# Altium schematic sheet RF_TRANSMITTER_Schematic.SchDoc
size A4; SheetNumber: 1; SheetTotal: 1
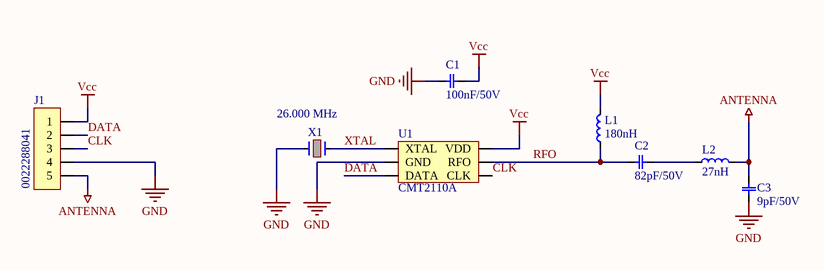
[diagram p0: RF_TRANSMITTER_Schematic.SchDoc]

## Parts
C1  100nF/50V  [Cap_0805]
C2  82pF/50V  [Cap_0805]
C3  9pF/50V  [Cap_0805]
J1  0022288041  [HDR_MALE_1x5_100mil_90DRC]
L1  180nH  [FERRITEBEAD_0805]
L2  27nH  [FERRITEBEAD_0805]
U1  CMT2110A  [SOT-23-6]
X1  26.000 MHz  [HC-49/US]

## Nets
ANTENNA: C3.2 J1.5 L2.2
GND: C1.1 C3.1 J1.4 U1.2(GND) X1.1
Vcc: C1.2 J1.1 L1.2 U1.6(VDD)
CLK: J1.3 U1.4(CLK)
DATA: J1.2 U1.3(DATA)
RFO: C2.2 L1.1 U1.5(RFO)
XTAL: U1.1(XTAL) X1.2
NetC2_1: C2.1 L2.1

## Library data of the parts
C1 = C2012X7R1H104K125AE: CAP CER nF 100 50V X7R 0805; Manufacturer: TDK Corporation; Tolerance: ±10%; Supplier 1: Digi-Key; Manufacturer Part Number: C2012X7R1H104K125AE; RoHS: RoHS Compliant; Category: Capacitors; Stock 1: 21863; Pricing 1: 1=0.29, 10=0.197, 100=0.1118, 500=0.07894, 1000=0.06907 (USD); Packaging: Cut Tape (CT); Part Status: Active; Voltage - Rated: 50V; Temperature Coefficient: X7R; Operating Temperature: -55°C ~ 125°C; Features: Soft Termination; Ratings: -; Applications: Boardflex Sensitive; Failure Rate: -; Mounting Type: Surface Mount, MLCC; Package / Case: 0805 (2012 Metric); Size / Dimension: 0.079" L x 0.049" W (2.00mm x 1.25mm); Height - Seated (Max): -; Thickness (Max): 0.057" (1.45mm); Lead Spacing: -; Lead Style: -; ComponentLink1URL: https://product.tdk.com/info/en/catalog/datasheets/mlcc_commercial_soft_en.pdf; ComponentLink1Description: https://product.tdk.com/info/en/catalog/datasheets/mlcc_commercial_soft_en.pdf; Supplier Part Number 1: 445-15929-1-ND
C2 = CC0805JRNPO9BN820: CAP CER pF 82 50V C0G/NPO 0805; Manufacturer: Yageo; Material: Ceramic; Capacitance: 82pF; Tolerance: 5%; Dielectric: C0G; Supplier 1: Digi-Key; Manufacturer Part Number: CC0805JRNPO9BN820; RoHS: Yes; Category: Ceramic Capacitors; Stock 1: 76000; Pricing 1: 4000=0,01566, 8000=0,01430 (USD); Mount: Surface Mount; Case/Package: 0805; Case Code (Imperial): 0805; Case Code (Metric): 2012; Weight: 0.000194oz; Min Operating Temperature: -55°C; Max Operating Temperature: 125°C; Package Quantity: 1; Voltage Rating: 50V; Voltage Rating (DC): 50V; Packaging: Tape and Reel; Termination: SMD/SMT; Resistor Type: Ceramic; Series: CC; Length: 2mm; Width: 1.25mm; Height: 0.6mm; Thickness: 0.024inch; Depth: 1.25mm; Radiation Hardening: No; Lead Free: Lead Free; RoHS Compliant: Yes; ComponentLink1URL: https://datasheet.ciiva.com/15189/getdatasheetpartid-137824-15189191.pdf?src-supplier=Verical; ComponentLink1Description: https://datasheet.ciiva.com/15189/getdatasheetpartid-137824-15189191.pdf?src-supplier=Verical; ComponentLink2URL: https://datasheet.ciiva.com/144/mlccorderingcode-144858.pdf?src-supplier=Digi-Key; ComponentLink2Description: https://datasheet.ciiva.com/144/mlccorderingcode-144858.pdf?src-supplier=Digi-Key; ComponentLink3URL: https://datasheet.ciiva.com/11586/upy-gp-np0-16v-to-50v-8-11586219.pdf?src-supplier=Avnet; ComponentLink3Description: https://datasheet.ciiva.com/11586/upy-gp-np0-16v-to-50v-8-11586219.pdf?src-supplier=Avnet; ComponentLink4URL: https://datasheet.ciiva.com/17434/upy-gp-np0-16v-to-50v-8-17434828.pdf?src-supplier=Avnet+Europe; ComponentLink4Description: https://datasheet.ciiva.com/17434/upy-gp-np0-16v-to-50v-8-17434828.pdf?src-supplier=Avnet+Europe; ComponentLink5URL: https://datasheet.ciiva.com/144/mlccorderingcode-144857.pdf?src-supplier=Digi-Key; ComponentLink5Description: https://datasheet.ciiva.com/144/mlccorderingcode-144857.pdf?src-supplier=Digi-Key; ComponentLink6URL: https://datasheet.ciiva.com/144/mlccorderingcode-144859.pdf?src-supplier=Digi-Key; ComponentLink6Description: https://datasheet.ciiva.com/144/mlccorderingcode-144859.pdf?src-supplier=Digi-Key; Supplier Part Number 1: 311-1110-2-ND
C3 = CC0805DRNPO9BN9R0: CAP CER pF 9 50V C0G/NPO 0805; Manufacturer: Yageo; Capacitance: 9pF; Dielectric: C0G; Supplier 1: Digi-Key; Manufacturer Part Number: CC0805DRNPO9BN9R0; RoHS: Yes; Category: Ceramic Capacitors; Stock 1: 20741; Pricing 1: 1=0,12000, 10=0,08400, 50=0,04740, 100=0,03930, 500=0,02754, 1000=0,02280 (USD); Mount: Surface Mount; Case/Package: 0805; Case Code (Metric): 2012; Case Code (Imperial): 0805; Weight: 0.000194oz; Min Operating Temperature: -55°C; Max Operating Temperature: 125°C; Package Quantity: 1; Voltage Rating: 50V; Packaging: Tape and Reel; Voltage Rating (DC): 50V; Termination: SMD/SMT; Series: CC; Length: 0.079inch; Width: 0.049inch; Thickness: 0.024inch; RoHS Compliant: Yes; ComponentLink1URL: https://datasheet.ciiva.com/176/mlccorderingcode-176816.pdf?src-supplier=Digi-Key; ComponentLink1Description: https://datasheet.ciiva.com/176/mlccorderingcode-176816.pdf?src-supplier=Digi-Key; ComponentLink2URL: https://datasheet.ciiva.com/176/mlccorderingcode-176817.pdf?src-supplier=Digi-Key; ComponentLink2Description: https://datasheet.ciiva.com/176/mlccorderingcode-176817.pdf?src-supplier=Digi-Key; ComponentLink3URL: https://datasheet.ciiva.com/176/mlccorderingcode-176818.pdf?src-supplier=Digi-Key; ComponentLink3Description: https://datasheet.ciiva.com/176/mlccorderingcode-176818.pdf?src-supplier=Digi-Key; Supplier Part Number 1: 311-1098-1-ND
J1 = 0022288041: CONN HEADER 4POS 2.54MM R/A; Manufacturer: Molex; Gender: Male; Voltage Rating (DC): 250V; Number of Circuits: 4; Current Rating: 4A; Connector Type: Male Pin; Pitch: 0.1inch; Glow Wire Compliant: Non-compliant; Supplier 1: Digi-Key; Manufacturer Part Number: 0022288041; Stock 1: 1112; Pricing 1: 1 = 0,34000, 10 = 0,32200, 25 = 0,27640, 50 = 0,23480, 100 = 0,22560, 250 = 0,20256, 500 = 0,19336 (USD); RoHS: Yes; Mount: Through Hole; Housing Color: Black; Color: Black; Contact Material: Brass; Contact Plating: Tin; Housing Material: Thermoplastic; Orientation: Right Angle; Number of Contacts: 4; Number of Positions: 4; Termination: Solder; Package Quantity: 1; Number of Rows: 1; Packaging: Bulk; Voltage Rating: 250V; Contact Mating Length: 0.324inch; Lead Free: Lead Free; Flammability Rating: UL94 V-0; ComponentLink1URL: https://datasheet.ciiva.com/10090/0022288041-pcb-headers-10090135.pdf?src-supplier=Avnet; ComponentLink1Description: https://datasheet.ciiva.com/10090/0022288041-pcb-headers-10090135.pdf?src-supplier=Avnet; ComponentLink2URL: https://datasheet.ciiva.com/6859/022288041-sd-6859126.pdf?src-supplier=Digi-Key; ComponentLink2Description: https://datasheet.ciiva.com/6859/022288041-sd-6859126.pdf?src-supplier=Digi-Key; Supplier Part Number 1: WM50025-04-ND
L1 = MLF2012DR18KTD25: FIXED IND nH 180 300MA 250MOHM SM; Manufacturer: TDK; Core Material: Ferrite; Tolerance: 10%; Shielding: Shielded; DC Resistance (DCR): 250mR; Self Resonant Frequency: 280MHz; Test Frequency: 25MHz; Q Factor: 20; Supplier 1: Digi-Key; Manufacturer Part Number: MLF2012DR18KTD25; RoHS: Yes; Category: Fixed Inductors; Stock 1: 4804; Pricing 1: 1=0,27000, 10=0,24300, 25=0,21240, 50=0,18220, 100=0,16700, 250=0,15180, 500=0,14270, 1000=0,10930 (USD); Mount: Surface Mount; Case/Package: 0805; Case Code (Metric): 2012; Case Code (Imperial): 0805; Weight: 0.000194oz; Min Operating Temperature: -55°C; Max Operating Temperature: 125°C; Package Quantity: 4000; Packaging: Tape and Reel; Current Rating: 300mA; Inductance: 180nH; Termination: SMD/SMT; Max DC Current: 300mA; Length: 0.079inch; Width: 0.049inch; Height: 0.85mm; Height - Seated (Max): 0.041inch; Ratings: AEC-Q200; RoHS Compliant: Yes; ComponentLink1URL: http://www.mouser.com/ds/2/400/nductor_commercial_standard_mlf2012_en-936986.pdf?src-supplier=Mouser; ComponentLink1Description: http://www.mouser.com/ds/2/400/nductor_commercial_standard_mlf2012_en-936986.pdf?src-supplier=Mouser; ComponentLink2URL: http://product.tdk.com/inductor/ind/en/documents/inductor_automotive_standard_mlf_en.pdf?src-supplier=Digi-Key; ComponentLink2Description: http://product.tdk.com/inductor/ind/en/documents/inductor_automotive_standard_mlf_en.pdf?src-supplier=Digi-Key; ComponentLink3URL: https://product.tdk.com/info/en/catalog/datasheets/inductor_automotive_standard_mlf2012_en.pdf?src-supplier=Digi-Key; ComponentLink3Description: https://product.tdk.com/info/en/catalog/datasheets/inductor_automotive_standard_mlf2012_en.pdf?src-supplier=Digi-Key; Supplier Part Number 1: 445-16992-1-ND
L2 = L-15W27NJV4E: FIXED IND nH 27 600MA 120MOHM SMD; Manufacturer: Johanson; Core Material: Ceramic; Tolerance: 5%; Shielding: Unshielded; DC Resistance (DCR): 120mR; Self Resonant Frequency: 2.6GHz; Test Frequency: 100MHz; Q Factor: 60; Supplier 1: Digi-Key; Manufacturer Part Number: L-15W27NJV4E; RoHS: Yes; Category: Fixed Inductors; Pricing 1: 4000=0,08127 (USD); Mount: Surface Mount; Case/Package: 0805; Case Code (Metric): 2012; Case Code (Imperial): 0805; Min Operating Temperature: -40°C; Max Operating Temperature: 125°C; Package Quantity: 2000; Current Rating: 600mA; Packaging: Tape and Reel; Resistor Type: Wirewound; Inductance: 27nH; Max DC Current: 600mA; Termination: SMD/SMT; DC Current: 600mA; Series: -; Length: 0.079inch; Width: 0.049inch; Height: 1.2mm; Height - Seated (Max): 0.055inch; Depth: 1.45mm; Military Standard: Not; RoHS Compliant: Yes; ComponentLink1URL: http://www.mouser.com/ds/2/611/jti-cat-ww-ind-541413.pdf?src-supplier=Mouser; ComponentLink1Description: http://www.mouser.com/ds/2/611/jti-cat-ww-ind-541413.pdf?src-supplier=Mouser; ComponentLink2URL: http://components.arrow.com/part/dataview/0323_01333189?src-supplier=Arrow+Europe; ComponentLink2Description: http://components.arrow.com/part/dataview/0323_01333189?src-supplier=Arrow+Europe; ComponentLink3URL: http://components.arrow.com/part/dataview/43911987S9161101N2069?src-supplier=Arrow+Electronics; ComponentLink3Description: http://components.arrow.com/part/dataview/43911987S9161101N2069?src-supplier=Arrow+Electronics; ComponentLink4URL: https://www.johansontechnology.com/downloads/jti-cat-ww-ind.pdf?src-supplier=Digi-Key; ComponentLink4Description: https://www.johansontechnology.com/downloads/jti-cat-ww-ind.pdf?src-supplier=Digi-Key; Supplier Part Number 1: L-15W27NJV4E-ND
U1 = CMT2110A-ESR: RF TRANSMITTER IC ASK/OOK 300-960MHZ SOT23-6 SMD; ComponentLink1Description: Datasheet; ComponentLink1URL: https://www.hoperf.com/data/upload/portal/20190624/CMT2210LH-Datasheet-EN-V0.5-180822.pdf
X1 = 9B-26.000MAAJ-B: CRYSTAL 26.0000MHZ 18PF TH; Manufacturer: TXC; Frequency Stability: 30ppm; Frequency: 26MHz; ESR (Equivalent Series Resistance): 30R; Supplier 1: Digi-Key; Manufacturer Part Number: 9B-26.000MAAJ-B; RoHS: Yes; Category: Crystals; Stock 1: 910; Pricing 1: 1=0,39000, 10=0,32500, 50=0,29240, 100=0,26000, 500=0,24700 (USD); Mount: Through Hole; Min Operating Temperature: -20°C; Max Operating Temperature: 70°C; Termination: Radial; Package Quantity: 1000; Frequency Tolerance: 30ppm; Load Capacitance: 18pF; Packaging: Bulk; Tolerance: 30ppm; Length: 0.453inch; Width: 0.197inch; Height: 0.145inch; REACH SVHC: No SVHC; Lead Free: Lead Free; ComponentLink1URL: https://datasheet.ciiva.com/855/9b-855203.pdf?src-supplier=Digi-Key; ComponentLink1Description: https://datasheet.ciiva.com/855/9b-855203.pdf?src-supplier=Digi-Key; ComponentLink2URL: https://datasheet.ciiva.com/1356/number-crystal-basic-1356799.pdf?src-supplier=Element14; ComponentLink2Description: https://datasheet.ciiva.com/1356/number-crystal-basic-1356799.pdf?src-supplier=Element14; Supplier Part Number 1: 887-1029-ND